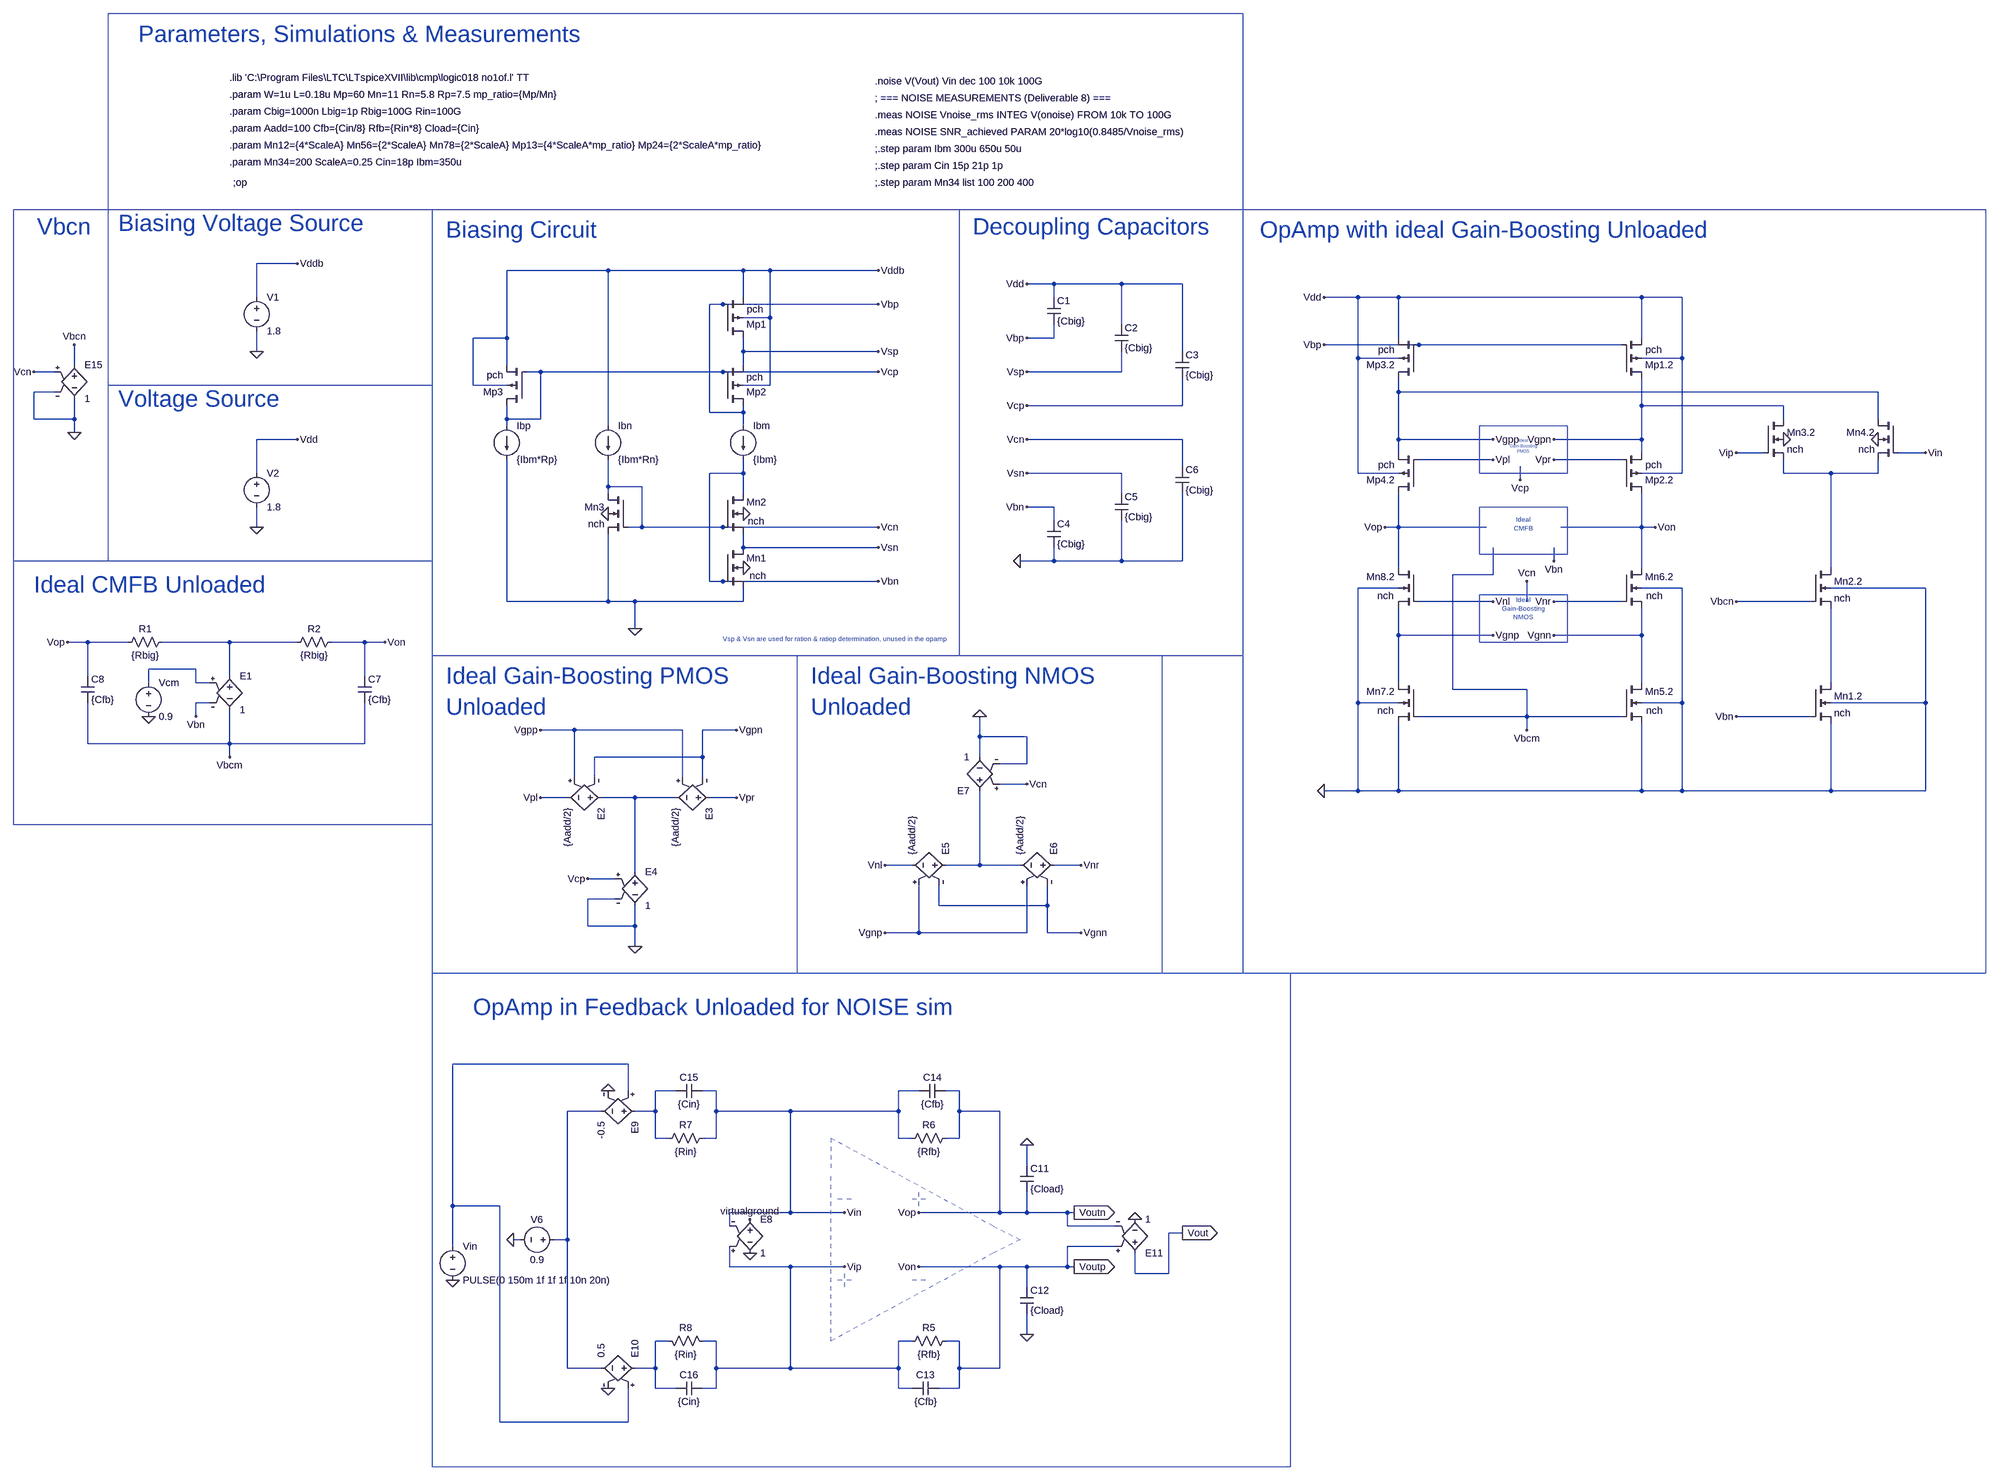
[diagram p0: schematic discrete_time_fully_differential_folded_cascode_amplifier_unloaded_noise_sim.asc]
discrete_time_fully_differential_folded_cascode_amplifier_unloaded_noise_sim.asc, the LTspice schematic file:
Version 4
SHEET 1 6308 3584
WIRE 480 -288 384 -288
WIRE 1216 -272 976 -272
WIRE 1536 -272 1216 -272
WIRE 1600 -272 1536 -272
WIRE 1856 -272 1600 -272
WIRE 2272 -240 2208 -240
WIRE 2432 -240 2272 -240
WIRE 2576 -240 2432 -240
WIRE 384 -208 384 -288
WIRE 1536 -208 1536 -272
WIRE 2272 -208 2272 -240
WIRE 2992 -208 2912 -208
WIRE 3088 -208 2992 -208
WIRE 3664 -208 3088 -208
WIRE 3760 -208 3664 -208
WIRE 1488 -192 1456 -192
WIRE 1856 -192 1488 -192
WIRE 1600 -160 1600 -272
WIRE 1600 -160 1536 -160
WIRE 2432 -144 2432 -240
WIRE 976 -112 976 -272
WIRE 976 -112 896 -112
WIRE 2272 -112 2272 -144
WIRE 2272 -112 2208 -112
WIRE 3088 -112 3088 -208
WIRE 3664 -112 3664 -208
WIRE 3136 -96 2912 -96
WIRE 3616 -96 3136 -96
WIRE 384 -80 384 -128
WIRE 1536 -80 1536 -112
WIRE 1856 -80 1536 -80
WIRE 2576 -80 2576 -240
WIRE 2992 -64 2992 -208
WIRE 3088 -64 2992 -64
WIRE 3760 -64 3760 -208
WIRE 3760 -64 3664 -64
WIRE -48 -48 -48 -96
WIRE 976 -48 976 -112
WIRE 1536 -48 1536 -80
WIRE -96 -32 -144 -32
WIRE 1056 -32 1024 -32
WIRE 1488 -32 1056 -32
WIRE 1856 -32 1488 -32
WIRE 2432 -32 2432 -80
WIRE 2432 -32 2208 -32
WIRE 896 0 896 -112
WIRE 976 0 896 0
WIRE 1600 0 1600 -160
WIRE 1600 0 1536 0
WIRE -96 16 -144 16
WIRE 3088 16 3088 -16
WIRE 4224 16 3088 16
WIRE 2576 48 2576 -16
WIRE 2576 48 2208 48
WIRE 3664 48 3664 -16
WIRE 4000 48 3664 48
WIRE 1456 64 1456 -192
WIRE 1536 64 1536 48
WIRE 1536 64 1456 64
WIRE -144 80 -144 16
WIRE -48 80 -48 32
WIRE -48 80 -144 80
WIRE 976 80 976 48
WIRE 1056 80 1056 -32
WIRE 1056 80 976 80
WIRE 4000 80 4000 48
WIRE 4224 80 4224 16
WIRE 976 96 976 80
WIRE 1216 96 1216 -272
WIRE 1536 96 1536 64
WIRE -48 112 -48 80
WIRE 480 128 384 128
WIRE 2576 128 2208 128
WIRE 3088 128 3088 16
WIRE 3312 128 3088 128
WIRE 3664 128 3664 48
WIRE 3664 128 3456 128
WIRE 3088 160 3088 128
WIRE 3664 160 3664 128
WIRE 3952 160 3888 160
WIRE 4336 160 4272 160
WIRE 3312 176 3136 176
WIRE 3616 176 3456 176
WIRE 2576 192 2576 128
WIRE 384 208 384 128
WIRE 1536 208 1536 176
WIRE 1536 208 1456 208
WIRE 2432 208 2208 208
WIRE 2992 208 2992 -64
WIRE 3088 208 2992 208
WIRE 3760 208 3760 -64
WIRE 3760 208 3664 208
WIRE 4000 208 4000 176
WIRE 4112 208 4000 208
WIRE 4224 208 4224 176
WIRE 4224 208 4112 208
WIRE 3376 224 3376 192
WIRE 1216 240 1216 176
WIRE 1296 240 1216 240
WIRE 1216 256 1216 240
WIRE 1536 256 1536 208
WIRE 2432 256 2432 208
WIRE 2272 288 2208 288
WIRE 2272 320 2272 288
WIRE 384 336 384 288
WIRE 1296 336 1296 240
WIRE 1296 336 1264 336
WIRE 1488 336 1296 336
WIRE 1856 336 1488 336
WIRE 3088 336 3088 256
WIRE 3088 336 3056 336
WIRE 3296 336 3088 336
WIRE 3664 336 3664 256
WIRE 3664 336 3472 336
WIRE 3696 336 3664 336
WIRE 1536 384 1536 352
WIRE 1856 384 1536 384
WIRE 2272 416 2272 384
WIRE 2272 416 2192 416
WIRE 2432 416 2432 320
WIRE 2432 416 2272 416
WIRE 2576 416 2576 256
WIRE 2576 416 2432 416
WIRE 3456 416 3456 384
WIRE 3088 432 3088 336
WIRE 3664 432 3664 336
WIRE 4112 432 4112 208
WIRE 3312 448 3312 384
WIRE 3312 448 3216 448
WIRE 1456 464 1456 208
WIRE 1488 464 1456 464
WIRE 1856 464 1488 464
WIRE 3088 480 2992 480
WIRE 3760 480 3664 480
WIRE 4336 480 4112 480
WIRE 976 512 976 176
WIRE 1216 512 1216 352
WIRE 1216 512 976 512
WIRE 1280 512 1216 512
WIRE 1536 512 1536 480
WIRE 1536 512 1280 512
WIRE 3312 512 3136 512
WIRE 3392 512 3392 464
WIRE 3616 512 3456 512
WIRE 4064 512 3888 512
WIRE 1280 576 1280 512
WIRE 3088 592 3088 528
WIRE 3312 592 3088 592
WIRE 3664 592 3664 528
WIRE 3664 592 3456 592
WIRE -16 608 -64 608
WIRE 80 608 -16 608
WIRE 320 608 160 608
WIRE 480 608 320 608
WIRE 640 608 560 608
WIRE 688 608 640 608
WIRE 240 672 128 672
WIRE -16 688 -16 608
WIRE 320 688 320 608
WIRE 640 688 640 608
WIRE 128 704 128 672
WIRE 240 704 240 672
WIRE 272 704 240 704
WIRE 3088 704 3088 592
WIRE 3664 704 3664 592
WIRE 4112 704 4112 528
WIRE 3216 720 3216 448
WIRE 3392 720 3216 720
WIRE 272 752 240 752
WIRE 2992 752 2992 480
WIRE 3088 752 2992 752
WIRE 3760 752 3760 480
WIRE 3760 752 3664 752
WIRE 4336 752 4336 480
WIRE 4336 752 4112 752
WIRE 240 784 240 752
WIRE 3392 784 3392 720
WIRE 3392 784 3136 784
WIRE 3616 784 3392 784
WIRE 4064 784 3888 784
WIRE 1136 816 1056 816
WIRE 1392 816 1136 816
WIRE 1520 816 1440 816
WIRE 3392 816 3392 784
WIRE 2096 832 2096 784
WIRE 2208 832 2096 832
WIRE -16 848 -16 752
WIRE 320 848 320 768
WIRE 320 848 -16 848
WIRE 640 848 640 752
WIRE 640 848 320 848
WIRE 320 880 320 848
WIRE 1440 880 1440 816
WIRE 1440 880 1184 880
WIRE 2096 880 2096 832
WIRE 2208 896 2208 832
WIRE 2208 896 2144 896
WIRE 1136 928 1136 816
WIRE 1184 928 1184 880
WIRE 1392 928 1392 816
WIRE 1440 928 1440 880
WIRE 2208 944 2144 944
WIRE 2992 960 2992 752
WIRE 2992 960 2912 960
WIRE 3088 960 3088 800
WIRE 3088 960 2992 960
WIRE 3664 960 3664 800
WIRE 3664 960 3088 960
WIRE 3760 960 3760 752
WIRE 3760 960 3664 960
WIRE 4112 960 4112 800
WIRE 4112 960 3760 960
WIRE 4336 960 4336 752
WIRE 4336 960 4112 960
WIRE 1120 976 1056 976
WIRE 1280 976 1200 976
WIRE 1376 976 1280 976
WIRE 1520 976 1456 976
WIRE 1936 1136 1872 1136
WIRE 2096 1136 2096 960
WIRE 2096 1136 2016 1136
WIRE 2192 1136 2096 1136
WIRE 2336 1136 2272 1136
WIRE 1280 1152 1280 976
WIRE 1232 1168 1168 1168
WIRE 1232 1216 1168 1216
WIRE 2000 1232 2000 1184
WIRE 2256 1232 2256 1184
WIRE 2256 1232 2000 1232
WIRE 1168 1280 1168 1216
WIRE 1280 1280 1280 1232
WIRE 1280 1280 1168 1280
WIRE 1952 1296 1952 1184
WIRE 1952 1296 1872 1296
WIRE 2208 1296 2208 1184
WIRE 2208 1296 1952 1296
WIRE 2256 1296 2256 1232
WIRE 2336 1296 2256 1296
WIRE 1280 1328 1280 1280
WIRE 1264 1648 848 1648
WIRE 1264 1712 1264 1648
WIRE 1376 1712 1328 1712
WIRE 1472 1712 1440 1712
WIRE 1952 1712 1904 1712
WIRE 2048 1712 2016 1712
WIRE 1200 1760 1120 1760
WIRE 1328 1760 1328 1712
WIRE 1328 1760 1280 1760
WIRE 1472 1760 1472 1712
WIRE 1648 1760 1472 1760
WIRE 1904 1760 1904 1712
WIRE 1904 1760 1648 1760
WIRE 2048 1760 2048 1712
WIRE 2144 1760 2048 1760
WIRE 1328 1824 1328 1760
WIRE 1360 1824 1328 1824
WIRE 1472 1824 1472 1760
WIRE 1472 1824 1440 1824
WIRE 1904 1824 1904 1760
WIRE 1936 1824 1904 1824
WIRE 2048 1824 2048 1760
WIRE 2048 1824 2016 1824
WIRE 2208 1888 2208 1840
WIRE 848 1984 848 1648
WIRE 960 1984 848 1984
WIRE 1648 2000 1648 1760
WIRE 1648 2000 1504 2000
WIRE 1776 2000 1648 2000
WIRE 2144 2000 2144 1760
WIRE 2144 2000 1952 2000
WIRE 2208 2000 2208 1952
WIRE 2208 2000 2144 2000
WIRE 2304 2000 2208 2000
WIRE 2320 2000 2304 2000
WIRE 1504 2032 1504 2000
WIRE 2304 2032 2304 2000
WIRE 2416 2032 2304 2032
WIRE 2576 2048 2544 2048
WIRE 1008 2064 992 2064
WIRE 1120 2064 1120 1760
WIRE 1120 2064 1088 2064
WIRE 848 2080 848 1984
WIRE 2416 2080 2304 2080
WIRE 1504 2128 1504 2080
WIRE 1648 2128 1504 2128
WIRE 1776 2128 1648 2128
WIRE 2144 2128 1952 2128
WIRE 2208 2128 2144 2128
WIRE 2304 2128 2304 2080
WIRE 2304 2128 2208 2128
WIRE 2320 2128 2304 2128
WIRE 2464 2144 2464 2096
WIRE 2544 2144 2544 2048
WIRE 2544 2144 2464 2144
WIRE 2208 2176 2208 2128
WIRE 2208 2288 2208 2240
WIRE 1360 2304 1328 2304
WIRE 1472 2304 1440 2304
WIRE 1936 2304 1904 2304
WIRE 2048 2304 2016 2304
WIRE 1120 2368 1120 2064
WIRE 1200 2368 1120 2368
WIRE 1328 2368 1328 2304
WIRE 1328 2368 1280 2368
WIRE 1472 2368 1472 2304
WIRE 1648 2368 1648 2128
WIRE 1648 2368 1472 2368
WIRE 1904 2368 1904 2304
WIRE 1904 2368 1648 2368
WIRE 2048 2368 2048 2304
WIRE 2144 2368 2144 2128
WIRE 2144 2368 2048 2368
WIRE 1328 2416 1328 2368
WIRE 1376 2416 1328 2416
WIRE 1472 2416 1472 2368
WIRE 1472 2416 1440 2416
WIRE 1904 2416 1904 2368
WIRE 1936 2416 1904 2416
WIRE 2048 2416 2048 2368
WIRE 2048 2416 2000 2416
WIRE 960 2496 960 1984
WIRE 1264 2496 1264 2416
WIRE 1264 2496 960 2496
FLAG 1280 576 0
FLAG 1856 -192 Vbp
FLAG 1856 -80 Vsp
FLAG 1856 -32 Vcp
FLAG 1856 336 Vcn
FLAG 1856 384 Vsn
FLAG 1856 464 Vbn
FLAG 1856 -272 Vddb
FLAG 1216 304 0
FLAG 1536 304 0
FLAG 1536 432 0
FLAG 384 -80 0
FLAG 480 -288 Vddb
FLAG 384 336 0
FLAG 480 128 Vdd
FLAG 2208 -240 Vdd
FLAG 2208 -112 Vbp
FLAG 2208 -32 Vsp
FLAG 2208 48 Vcp
FLAG 2208 288 Vbn
FLAG 2208 208 Vsn
FLAG 2208 128 Vcn
FLAG 2192 416 0
FLAG 128 784 0
FLAG 320 880 Vbcm
FLAG -64 608 Vop
FLAG 688 608 Von
FLAG 240 784 Vbn
FLAG 1280 1328 0
FLAG 1520 816 Vgpn
FLAG 1056 816 Vgpp
FLAG 1056 976 Vpl
FLAG 1520 976 Vpr
FLAG 1168 1168 Vcp
FLAG 2096 784 0
FLAG 2336 1296 Vgnn
FLAG 1872 1296 Vgnp
FLAG 1872 1136 Vnl
FLAG 2336 1136 Vnr
FLAG 2208 944 Vcn
FLAG 3312 128 Vgpp
FLAG 3312 176 Vpl
FLAG 3456 128 Vgpn
FLAG 3456 176 Vpr
FLAG 3376 224 Vcp
FLAG 2912 -208 Vdd
FLAG 2912 -96 Vbp
FLAG 3456 416 Vbn
FLAG 3056 336 Vop
FLAG 3696 336 Von
FLAG 3312 512 Vnl
FLAG 3456 512 Vnr
FLAG 3456 592 Vgnn
FLAG 3312 592 Vgnp
FLAG 3392 464 Vcn
FLAG 3392 816 Vbcm
FLAG 2912 960 0
FLAG 4224 128 0
FLAG 4000 128 0
FLAG 3888 160 Vip
FLAG 4336 160 Vin
FLAG 3888 512 Vbcn
FLAG 3888 784 Vbn
FLAG 1952 2000 Vop
FLAG 1952 2128 Von
FLAG -144 -32 Vcn
FLAG -48 112 0
FLAG -48 -96 Vbcn
FLAG 2208 1840 0
FLAG 2320 2000 Voutn
IOPIN 2320 2000 Out
FLAG 2320 2128 Voutp
IOPIN 2320 2128 Out
FLAG 2208 2288 0
FLAG 1776 2000 Vin
FLAG 1776 2128 Vip
FLAG 992 2064 0
FLAG 1552 2016 virtualground
FLAG 1216 1712 0
FLAG 1552 2096 0
FLAG 1216 2416 0
FLAG 848 2160 0
FLAG 2464 2016 0
FLAG 2576 2048 Vout
IOPIN 2576 2048 Out
DATAFLAG 1712 -192 ""
DATAFLAG 1712 -80 ""
DATAFLAG 1712 -32 ""
DATAFLAG 1728 336 ""
DATAFLAG 1728 384 ""
DATAFLAG 1728 464 ""
SYMBOL pmos4 1488 -112 M180
WINDOW 3 57 68 Left 2
SYMATTR Value pch
SYMATTR InstName Mp1
SYMATTR Value2 l={L} w={W} m={Mp}
SYMBOL pmos4 1488 48 M180
WINDOW 3 56 67 Left 2
SYMATTR Value pch
SYMATTR InstName Mp2
SYMATTR Value2 l={L} w={W} m={Mp}
SYMBOL pmos4 1024 48 R180
SYMATTR InstName Mp3
SYMATTR Value pch
SYMATTR Value2 l={L} w={W} m={Mp}
SYMBOL nmos4 1488 384 R0
WINDOW 0 56 25 Left 2
WINDOW 3 63 67 Left 2
SYMATTR InstName Mn1
SYMATTR Value nch
SYMATTR Value2 l={L} w={W} m={Mn}
SYMBOL nmos4 1488 256 R0
WINDOW 0 56 21 Left 2
WINDOW 3 59 66 Left 2
SYMATTR InstName Mn2
SYMATTR Value nch
SYMATTR Value2 l={L} w={W} m={Mn}
SYMBOL nmos4 1264 256 M0
SYMATTR InstName Mn3
SYMATTR Value nch
SYMATTR Value2 l={L} w={W} m={Mn}
SYMBOL current 1536 96 R0
SYMATTR InstName Ibm
SYMATTR Value {Ibm}
SYMBOL current 1216 96 R0
WINDOW 123 0 0 Left 0
WINDOW 39 0 0 Left 0
SYMATTR InstName Ibn
SYMATTR Value {Ibm*Rn}
SYMBOL current 976 96 R0
WINDOW 123 0 0 Left 0
WINDOW 39 0 0 Left 0
SYMATTR InstName Ibp
SYMATTR Value {Ibm*Rp}
SYMBOL voltage 384 -224 R0
WINDOW 123 0 0 Left 0
WINDOW 39 0 0 Left 0
SYMATTR InstName V1
SYMATTR Value 1.8
SYMBOL voltage 384 192 R0
WINDOW 123 0 0 Left 0
WINDOW 39 0 0 Left 0
SYMATTR InstName V2
SYMATTR Value 1.8
SYMBOL cap 2256 -208 R0
SYMATTR InstName C1
SYMATTR Value {Cbig}
SYMBOL cap 2416 -144 R0
SYMATTR InstName C2
SYMATTR Value {Cbig}
SYMBOL cap 2560 -80 R0
SYMATTR InstName C3
SYMATTR Value {Cbig}
SYMBOL cap 2256 384 M180
WINDOW 0 24 56 Left 2
WINDOW 3 24 8 Left 2
SYMATTR InstName C4
SYMATTR Value {Cbig}
SYMBOL cap 2416 320 M180
WINDOW 0 24 56 Left 2
WINDOW 3 24 8 Left 2
SYMATTR InstName C5
SYMATTR Value {Cbig}
SYMBOL cap 2560 256 M180
WINDOW 0 24 56 Left 2
WINDOW 3 24 8 Left 2
SYMATTR InstName C6
SYMATTR Value {Cbig}
SYMBOL e 320 672 R0
SYMATTR InstName E1
SYMATTR Value 1
SYMBOL res 176 592 R90
WINDOW 0 0 56 VBottom 2
WINDOW 3 32 56 VTop 2
SYMATTR InstName R1
SYMATTR Value {Rbig}
SYMBOL res 576 592 R90
WINDOW 0 0 56 VBottom 2
WINDOW 3 32 56 VTop 2
SYMATTR InstName R2
SYMATTR Value {Rbig}
SYMBOL cap 624 688 R0
SYMATTR InstName C7
SYMATTR Value {Cfb}
SYMBOL cap -32 688 R0
SYMATTR InstName C8
SYMATTR Value {Cfb}
SYMBOL voltage 128 688 R0
WINDOW 123 0 0 Left 0
WINDOW 39 0 0 Left 0
SYMATTR InstName Vcm
SYMATTR Value 0.9
SYMBOL e2 1216 976 R90
SYMATTR InstName E2
SYMATTR Value {Aadd/2}
SYMBOL e2 1472 976 R90
SYMATTR InstName E3
SYMATTR Value {Aadd/2}
SYMBOL e 1280 1136 R0
SYMATTR InstName E4
SYMATTR Value 1
SYMBOL e2 2032 1136 M270
SYMATTR InstName E5
SYMATTR Value {Aadd/2}
SYMBOL e2 2288 1136 M270
SYMATTR InstName E6
SYMATTR Value {Aadd/2}
SYMBOL e 2096 976 R180
SYMATTR InstName E7
SYMATTR Value 1
SYMBOL pmos4 3616 -16 M180
WINDOW 3 57 68 Left 2
SYMATTR Value pch
SYMATTR InstName Mp1.2
SYMATTR Value2 l={L} w={W} m={Mp13}
SYMBOL nmos4 3616 704 R0
WINDOW 0 56 21 Left 2
WINDOW 3 59 66 Left 2
SYMATTR InstName Mn5.2
SYMATTR Value nch
SYMATTR Value2 l={L} w={W} m={Mn56}
SYMBOL pmos4 3616 256 M180
WINDOW 3 57 68 Left 2
SYMATTR Value pch
SYMATTR InstName Mp2.2
SYMATTR Value2 l={L} w={W} m={Mp24}
SYMBOL nmos4 3616 432 R0
WINDOW 0 56 21 Left 2
WINDOW 3 59 66 Left 2
SYMATTR InstName Mn6.2
SYMATTR Value nch
SYMATTR Value2 l={L} w={W} m={Mn56}
SYMBOL pmos4 3136 -16 R180
WINDOW 3 57 68 Left 2
SYMATTR Value pch
SYMATTR InstName Mp3.2
SYMATTR Value2 l={L} w={W} m={Mp13}
SYMBOL nmos4 3136 704 M0
WINDOW 0 56 21 Left 2
WINDOW 3 59 66 Left 2
SYMATTR InstName Mn7.2
SYMATTR Value nch
SYMATTR Value2 l={L} w={W} m={Mn78}
SYMBOL pmos4 3136 256 R180
WINDOW 3 57 68 Left 2
SYMATTR Value pch
SYMATTR InstName Mp4.2
SYMATTR Value2 l={L} w={W} m={Mp24}
SYMBOL nmos4 3136 432 M0
WINDOW 0 56 21 Left 2
WINDOW 3 59 66 Left 2
SYMATTR InstName Mn8.2
SYMATTR Value nch
SYMATTR Value2 l={L} w={W} m={Mn78}
SYMBOL nmos4 4272 80 M0
SYMATTR InstName Mn4.2
SYMATTR Value nch
SYMATTR Value2 l={L} w={W} m={Mn34}
SYMBOL nmos4 3952 80 R0
SYMATTR InstName Mn3.2
SYMATTR Value nch
SYMATTR Value2 l={L} w={W} m={Mn34}
SYMBOL nmos4 4064 432 R0
SYMATTR InstName Mn2.2
SYMATTR Value nch
SYMATTR Value2 l={L} w={W} m={Mn12}
SYMBOL nmos4 4064 704 R0
SYMATTR InstName Mn1.2
SYMATTR Value nch
SYMATTR Value2 l={L} w={W} m={Mn12}
SYMBOL e -48 -64 R0
SYMATTR InstName E15
SYMATTR Value 1
SYMBOL cap 2192 1888 R0
SYMATTR InstName C11
SYMATTR Value {Cload}
SYMBOL cap 2192 2240 M180
WINDOW 0 24 56 Left 2
WINDOW 3 24 8 Left 2
SYMATTR InstName C12
SYMATTR Value {Cload}
SYMBOL res 2032 2288 R90
WINDOW 0 0 56 VBottom 2
WINDOW 3 32 56 VTop 2
SYMATTR InstName R5
SYMATTR Value {Rfb}
SYMBOL cap 2000 2400 R90
WINDOW 0 0 32 VBottom 2
WINDOW 3 32 32 VTop 2
SYMATTR InstName C13
SYMATTR Value {Cfb}
SYMBOL res 1920 1840 R270
WINDOW 0 32 56 VTop 2
WINDOW 3 0 56 VBottom 2
SYMATTR InstName R6
SYMATTR Value {Rfb}
SYMBOL cap 1952 1728 R270
WINDOW 0 32 32 VTop 2
WINDOW 3 0 32 VBottom 2
SYMATTR InstName C14
SYMATTR Value {Cfb}
SYMBOL res 1344 1840 R270
WINDOW 0 32 56 VTop 2
WINDOW 3 0 56 VBottom 2
SYMATTR InstName R7
SYMATTR Value {Rin}
SYMBOL cap 1376 1728 R270
WINDOW 0 32 32 VTop 2
WINDOW 3 0 32 VBottom 2
SYMATTR InstName C15
SYMATTR Value {Cin}
SYMBOL res 1344 2288 M90
WINDOW 0 0 56 VBottom 2
WINDOW 3 32 56 VTop 2
SYMATTR InstName R8
SYMATTR Value {Rin}
SYMBOL cap 1376 2400 M90
WINDOW 0 0 32 VBottom 2
WINDOW 3 32 32 VTop 2
SYMATTR InstName C16
SYMATTR Value {Cin}
SYMBOL voltage 1104 2064 R90
WINDOW 0 -32 56 VBottom 2
WINDOW 3 32 56 VTop 2
WINDOW 123 0 0 Left 0
WINDOW 39 0 0 Left 0
SYMATTR InstName V6
SYMATTR Value 0.9
SYMBOL e2 1552 2000 R0
SYMATTR InstName E8
SYMATTR Value 1
SYMBOL e 1296 1760 R90
SYMATTR InstName E9
SYMATTR Value -0.5
SYMBOL e 1296 2368 M270
SYMATTR InstName E10
SYMATTR Value 0.5
SYMBOL voltage 848 2064 R0
WINDOW 123 0 0 Left 0
WINDOW 39 0 0 Left 0
SYMATTR InstName Vin
SYMATTR Value PULSE(0 150m 1f 1f 1f 10n 20n)
SYMBOL e 2464 2112 M180
SYMATTR InstName E11
SYMATTR Value 1
TEXT 320 -688 Left 2 !.param W=1u L=0.18u Mp=60 Mn=11 Rn=5.8 Rp=7.5 mp_ratio={Mp/Mn}
TEXT 320 -728 Left 2 !.lib 'C:\\Program Files\\LTC\\LTspiceXVII\\lib\\cmp\\logic018 no1of.l' TT
TEXT 832 -368 Left 5 ;Biasing Circuit
TEXT 56 -384 Left 5 ;Biasing Voltage Source
TEXT 56 32 Left 5 ;Voltage Source
TEXT 320 -648 Left 2 !.param Cbig=1000n Lbig=1p Rbig=100G Rin=100G
TEXT 2080 -376 Left 5 ;Decoupling Capacitors
TEXT -144 472 Left 5 ;Ideal CMFB Unloaded
TEXT 832 688 Left 5 ;Ideal Gain-Boosting PMOS\nUnloaded
TEXT 1696 688 Left 5 ;Ideal Gain-Boosting NMOS\nUnloaded
TEXT 3384 144 Center 0 ;Ideal\nGain-Boosting\nPMOS
TEXT 3384 328 Center 1 ;Ideal\nCMFB
TEXT 3384 528 Center 1 ;Ideal\nGain-Boosting\nNMOS
TEXT 2760 -368 Left 5 ;OpAmp with ideal Gain-Boosting Unloaded
TEXT 1488 600 Left 1 ;Vsp & Vsn are used for ration & ratiop determination, unused in the opamp
TEXT -136 -376 Left 5 ;Vbcn
TEXT 896 1472 Left 5 ;OpAmp in Feedback Unloaded for NOISE sim
TEXT 320 -608 Left 2 !.param Aadd=100 Cfb={Cin/8} Rfb={Rin*8} Cload={Cin}
TEXT 320 -568 Left 2 !.param Mn12={4*ScaleA} Mn56={2*ScaleA} Mn78={2*ScaleA} Mp13={4*ScaleA*mp_ratio} Mp24={2*ScaleA*mp_ratio}
TEXT 320 -528 Left 2 !.param Mn34=200 ScaleA=0.25 Cin=18p Ibm=350u
TEXT 328 -480 Left 2 !;op
TEXT 1848 -720 Left 2 !.noise V(Vout) Vin dec 100 10k 100G
TEXT 1848 -680 Left 2 !; === NOISE MEASUREMENTS (Deliverable 8) ===
TEXT 1848 -640 Left 2 !.meas NOISE Vnoise_rms INTEG V(onoise) FROM 10k TO 100G
TEXT 1848 -600 Left 2 !.meas NOISE SNR_achieved PARAM 20*log10(0.8485/Vnoise_rms)
TEXT 1848 -560 Left 2 !;.step param Ibm 300u 650u 50u
TEXT 1848 -520 Left 2 !;.step param Cin 15p 21p 1p
TEXT 1848 -480 Left 2 !;.step param Mn34 list 100 200 400
TEXT 104 -832 Left 5 ;Parameters, Simulations & Measurements
LINE Normal 1744 2224 1744 1904 2
LINE Normal 1792 1968 1760 1968 2
LINE Normal 1776 2176 1776 2144 2
LINE Normal 1792 2160 1760 2160 2
LINE Normal 1952 1984 1952 1952 2
LINE Normal 1968 1968 1936 1968 2
LINE Normal 1968 2160 1936 2160 2
LINE Normal 1744 1824 1744 1904 2
LINE Normal 2128 2032 1744 1824 2
LINE Normal 1744 2304 1744 2224 2
LINE Normal 2128 2096 1744 2304 2
LINE Normal 2192 2064 2128 2096 2
LINE Normal 2128 2032 2192 2064 2
RECTANGLE Normal 2048 640 800 -416
RECTANGLE Normal 32 0 800 -416
RECTANGLE Normal 32 416 800 0
RECTANGLE Normal 2720 640 2048 -416
RECTANGLE Normal -192 1040 800 416
RECTANGLE Normal 1664 1392 800 640
RECTANGLE Normal 2528 1392 1664 640
RECTANGLE Normal 3488 208 3280 96
RECTANGLE Normal 3488 400 3280 288
RECTANGLE Normal 3488 608 3280 496
RECTANGLE Normal 4512 1392 2720 -416
RECTANGLE Normal -192 416 32 -416
RECTANGLE Normal 2832 2608 800 1392
RECTANGLE Normal 2720 -880 32 -416

The netlist it stands for:
* discrete_time_fully_differential_folded_cascode_amplifier_unloaded_noise_sim.asc
Mp1 Vsp Vbp Vddb Vddb pch l={L} w={W} m={Mp}
Mp2 Vbp Vcp Vsp Vddb pch l={L} w={W} m={Mp}
Mp3 Vcp Vcp Vddb Vddb pch l={L} w={W} m={Mp}
Mn1 Vsn Vbn 0 0 nch l={L} w={W} m={Mn}
Mn2 Vbn Vcn Vsn 0 nch l={L} w={W} m={Mn}
Mn3 Vcn Vcn 0 0 nch l={L} w={W} m={Mn}
Ibm Vbp Vbn {Ibm}
Ibn Vddb Vcn {Ibm*Rn}
Ibp Vcp 0 {Ibm*Rp}
V1 Vddb 0 1.8
V2 Vdd 0 1.8
C1 Vdd Vbp {Cbig}
C2 Vdd Vsp {Cbig}
C3 Vdd Vcp {Cbig}
C4 0 Vbn {Cbig}
C5 0 Vsn {Cbig}
C6 0 Vcn {Cbig}
E1 N002 Vbcm N003 Vbn 1
R1 N002 Voutn {Rbig}
R2 Voutp N002 {Rbig}
C7 Voutp Vbcm {Cfb}
C8 Voutn Vbcm {Cfb}
Vcm N003 0 0.9
E2 N005 Vpl Vgpp Vgpn {Aadd/2}
E3 Vpr N005 Vgpp Vgpn {Aadd/2}
E4 N005 0 Vcp 0 1
E5 N006 Vnl Vgnp Vgnn {Aadd/2}
E6 Vnr N006 Vgnp Vgnn {Aadd/2}
E7 N006 0 Vcn 0 1
Mp1.2 Vgpn Vbp Vdd Vdd pch l={L} w={W} m={Mp13}
Mn5.2 Vgnn Vbcm 0 0 nch l={L} w={W} m={Mn56}
Mp2.2 Voutp Vpr Vgpn Vdd pch l={L} w={W} m={Mp24}
Mn6.2 Voutp Vnr Vgnn 0 nch l={L} w={W} m={Mn56}
Mp3.2 Vgpp Vbp Vdd Vdd pch l={L} w={W} m={Mp13}
Mn7.2 Vgnp Vbcm 0 0 nch l={L} w={W} m={Mn78}
Mp4.2 Voutn Vpl Vgpp Vdd pch l={L} w={W} m={Mp24}
Mn8.2 Voutn Vnl Vgnp 0 nch l={L} w={W} m={Mn78}
Mn4.2 Vgpp Vin N001 0 nch l={L} w={W} m={Mn34}
Mn3.2 Vgpn Vip N001 0 nch l={L} w={W} m={Mn34}
Mn2.2 N001 Vbcn N004 0 nch l={L} w={W} m={Mn12}
Mn1.2 N004 Vbn 0 0 nch l={L} w={W} m={Mn12}
E15 Vbcn 0 Vcn 0 1
C11 0 Voutn {Cload}
C12 0 Voutp {Cload}
R5 Voutp Vip {Rfb}
C13 Voutp Vip {Cfb}
R6 Vin Voutn {Rfb}
C14 Vin Voutn {Cfb}
R7 N008 Vin {Rin}
C15 N008 Vin {Cin}
R8 N010 Vip {Rin}
C16 N010 Vip {Cin}
V6 N009 0 0.9
E8 virtualground 0 Vip Vin 1
E9 N008 N009 N007 0 -0.5
E10 N010 N009 N007 0 0.5
Vin N007 0 PULSE(0 150m 1f 1f 1f 10n 20n)
E11 Vout 0 Voutp Voutn 1
.model NMOS NMOS
.model PMOS PMOS
.lib standard.mos
.param W=1u L=0.18u Mp=60 Mn=11 Rn=5.8 Rp=7.5 mp_ratio={Mp/Mn}
.lib 'C:\Program Files\LTC\LTspiceXVII\lib\cmp\logic018 no1of.l' TT
* Biasing Circuit
* Biasing Voltage Source
* Voltage Source
.param Cbig=1000n Lbig=1p Rbig=100G Rin=100G
* Decoupling Capacitors
* Ideal CMFB Unloaded
* Ideal Gain-Boosting PMOS
* Unloaded
* Ideal Gain-Boosting NMOS
* Unloaded
* Ideal
* Gain-Boosting
* PMOS
* Ideal
* CMFB
* Ideal
* Gain-Boosting
* NMOS
* OpAmp with ideal Gain-Boosting Unloaded
* Vsp & Vsn are used for ration & ratiop determination, unused in the opamp
* Vbcn
* OpAmp in Feedback Unloaded for NOISE sim
.param Aadd=100 Cfb={Cin/8} Rfb={Rin*8} Cload={Cin}
.param Mn12={4*ScaleA} Mn56={2*ScaleA} Mn78={2*ScaleA} Mp13={4*ScaleA*mp_ratio} Mp24={2*ScaleA*mp_ratio}
.param Mn34=200 ScaleA=0.25 Cin=18p Ibm=350u
;op
.noise V(Vout) Vin dec 100 10k 100G
; === NOISE MEASUREMENTS (Deliverable 8) ===
.meas NOISE Vnoise_rms INTEG V(onoise) FROM 10k TO 100G
.meas NOISE SNR_achieved PARAM 20*log10(0.8485/Vnoise_rms)
;.step param Ibm 300u 650u 50u
;.step param Cin 15p 21p 1p
;.step param Mn34 list 100 200 400
* Parameters, Simulations & Measurements
.backanno
.end